# EasyEDA schematic NE555_dutycycle.json
TITLE: Sheet_1; REV: 1.0; Date: 2024-03-22; Sheet: 1/1; Company: Your Company
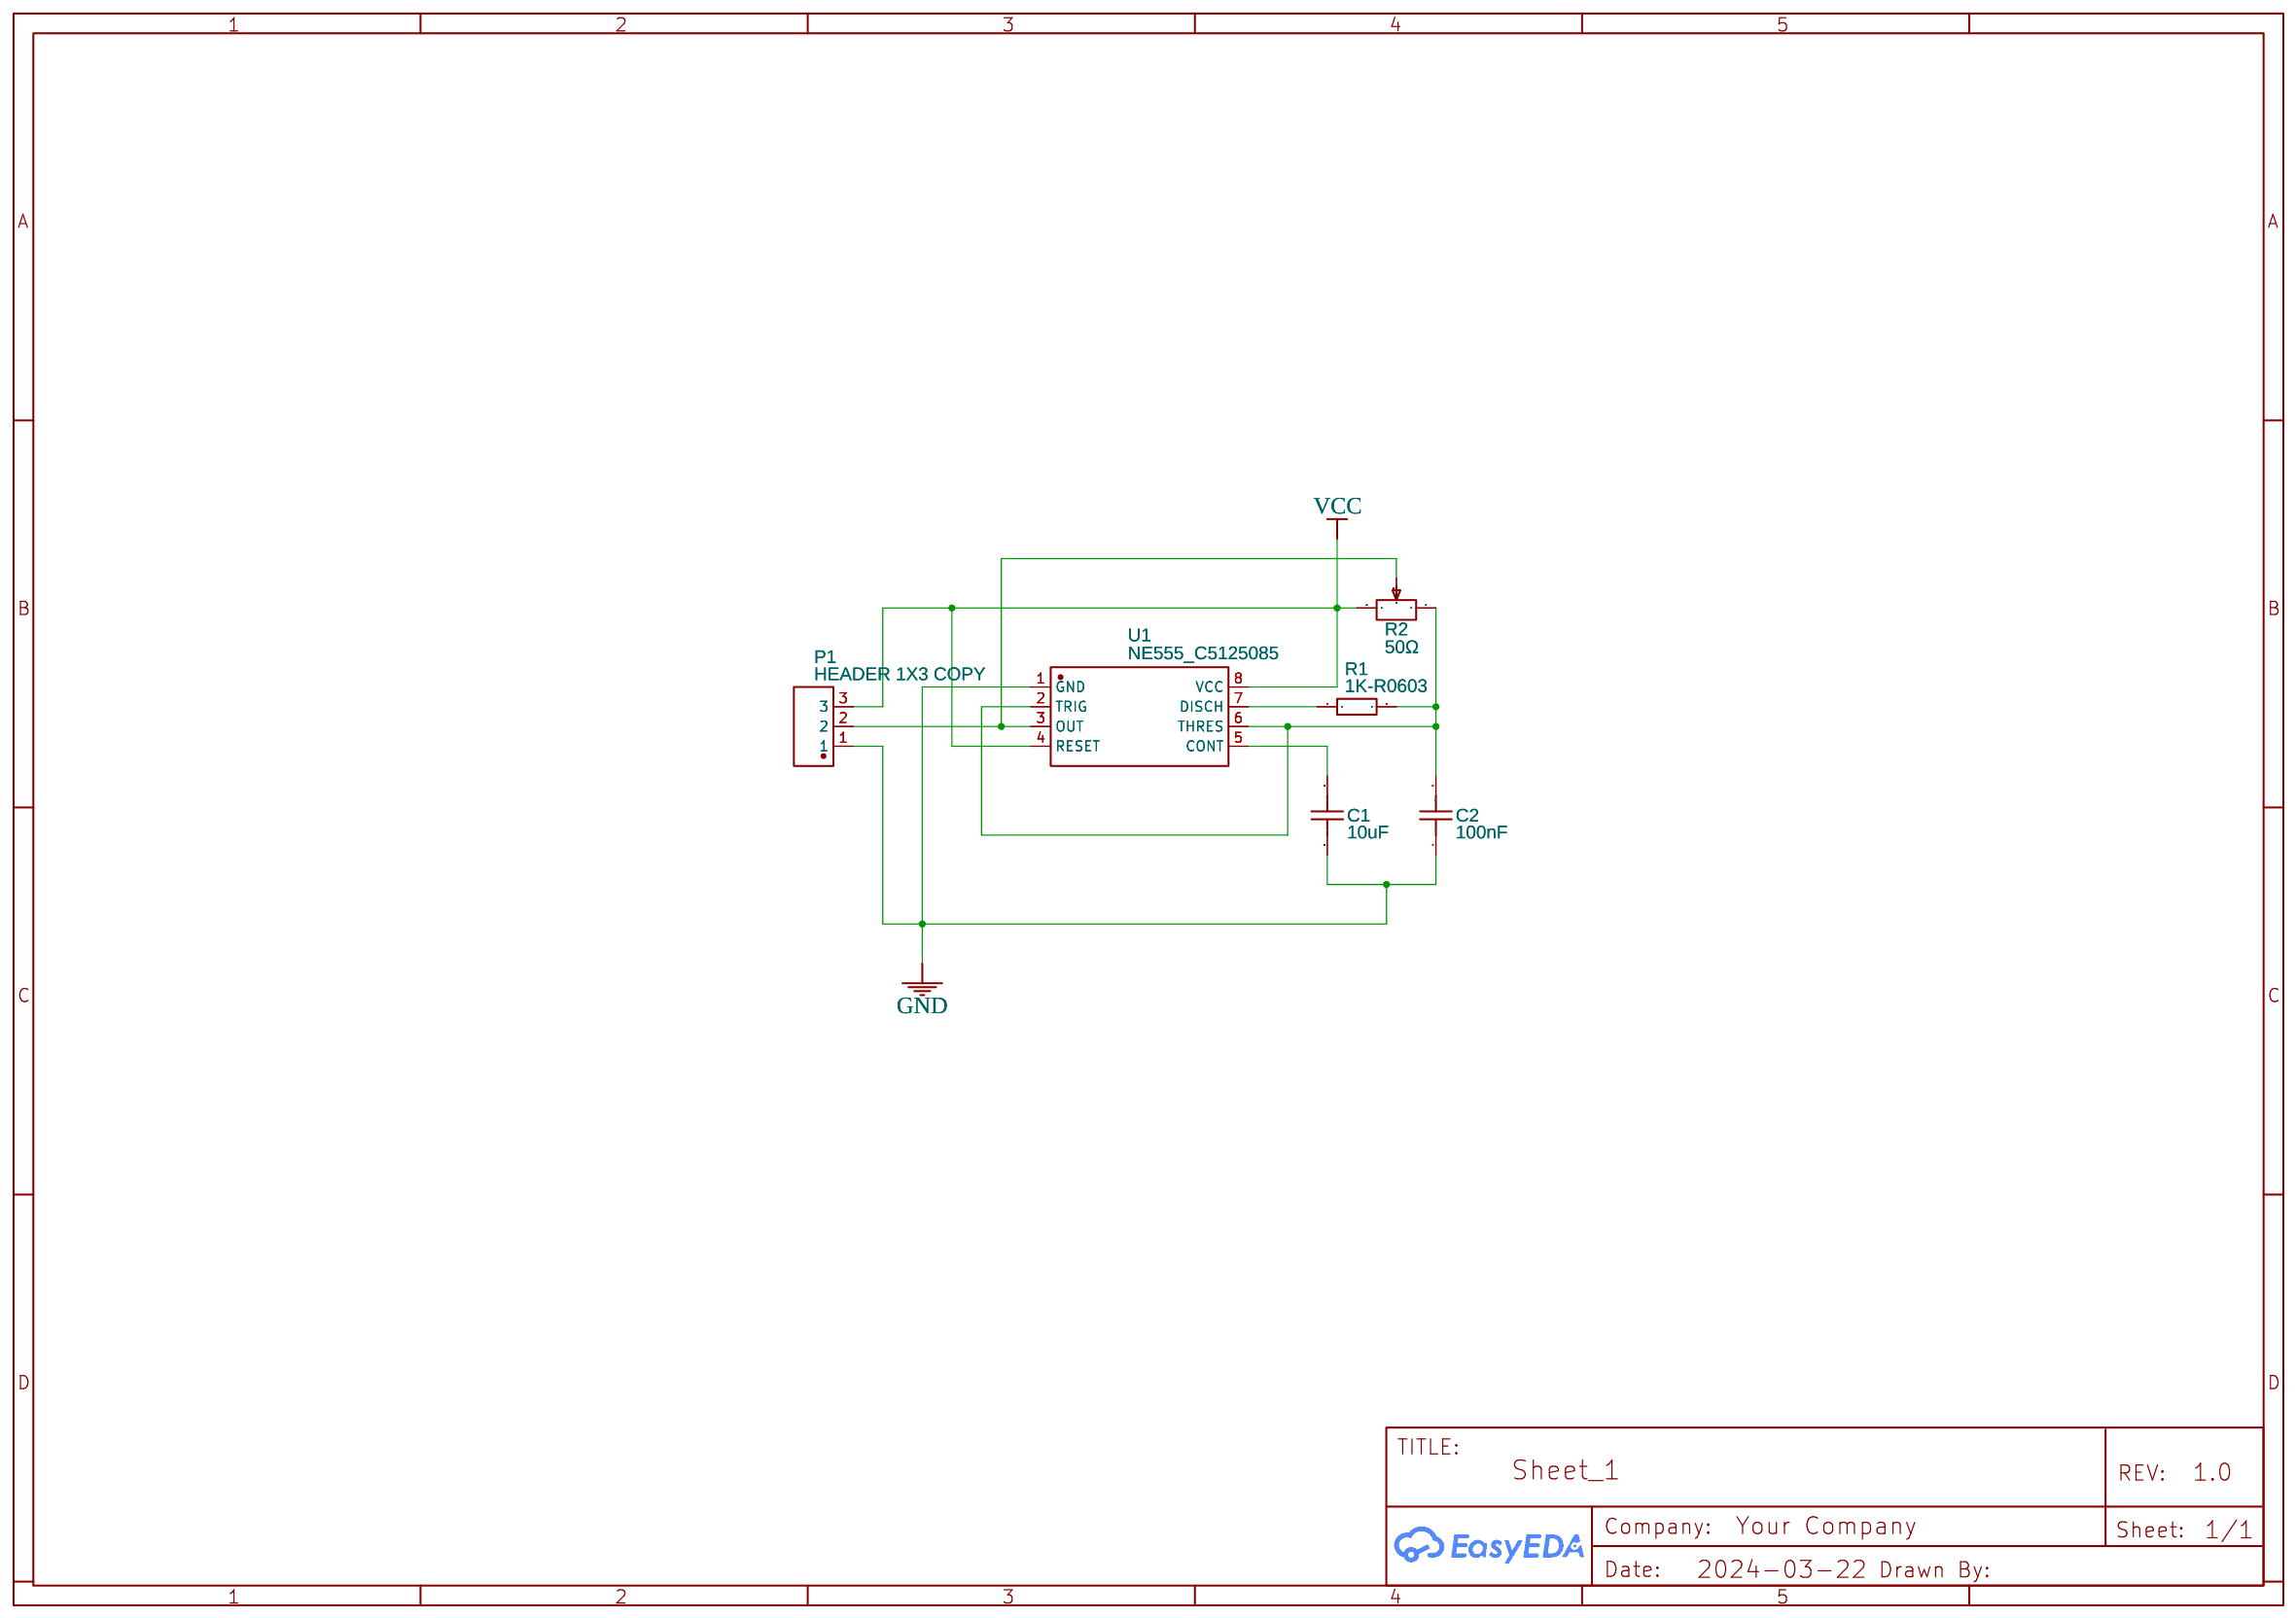
[diagram p0: schematic sheet]

## Parts
C1  10uF  [C0603]
C2  100nF  [C0603]
P1  HEADER 1X3 COPY  [1X3-PIN-HEADER-2.54MM_ES]
R1  1K-R0603  [R0603]
R2  50Ω  [RES-ADJ-TH_3296W]
U1  NE555_C5125085  [SOIC-8_L4.9-W3.9-P1.27-LS6.0-BL]

## Library data of the parts
C1 C2 = C_0603_US: Contributor: LCEDA_Lib
P1 = HEADER 1X3 COPY: Supplier: LCSC; Supplier Part: C705186; Manufacturer: XFCN; Manufacturer Part: M3025V-1x6P; Contributor: erzyk; JLCPCB Part Class: Extended Part
R1 = 1K-R0603: Contributor: LCSC; Supplier: LCSC; Supplier Part: C9900009267; Manufacturer: null; JLCPCB Part Class: Extended Part
R2 = Precision potentiometer 3296W/50ohm: Supplier Part: C21881; Supplier: LCSC; Manufacturer: ReliaPro; JLCPCB Part Class: Extended Part
U1 = NE555_C5125085: Contributor: lcsc; Supplier: LCSC; Supplier Part: C5125085; Manufacturer: IDCHIP(英锐芯); Manufacturer Part: NE555; JLCPCB Part Class: Extended Part

## Nets
GND: C1.1 C2.1 P1.1 U1.1(GND)
VCC: P1.3 R2.3 U1.4(RESET) U1.8(VCC)
Net-(C1-2): C1.2 U1.5(CONT)
Net-(C2-2): C2.2 R1.2 R2.1 U1.2(TRIG) U1.6(THRES)
Net-(P1-2): P1.2 R2.2 U1.3(OUT)
Net-(R1-1): R1.1 U1.7(DISCH)
